# Altium schematic sheet MP3_Decoder.SchDoc
size B
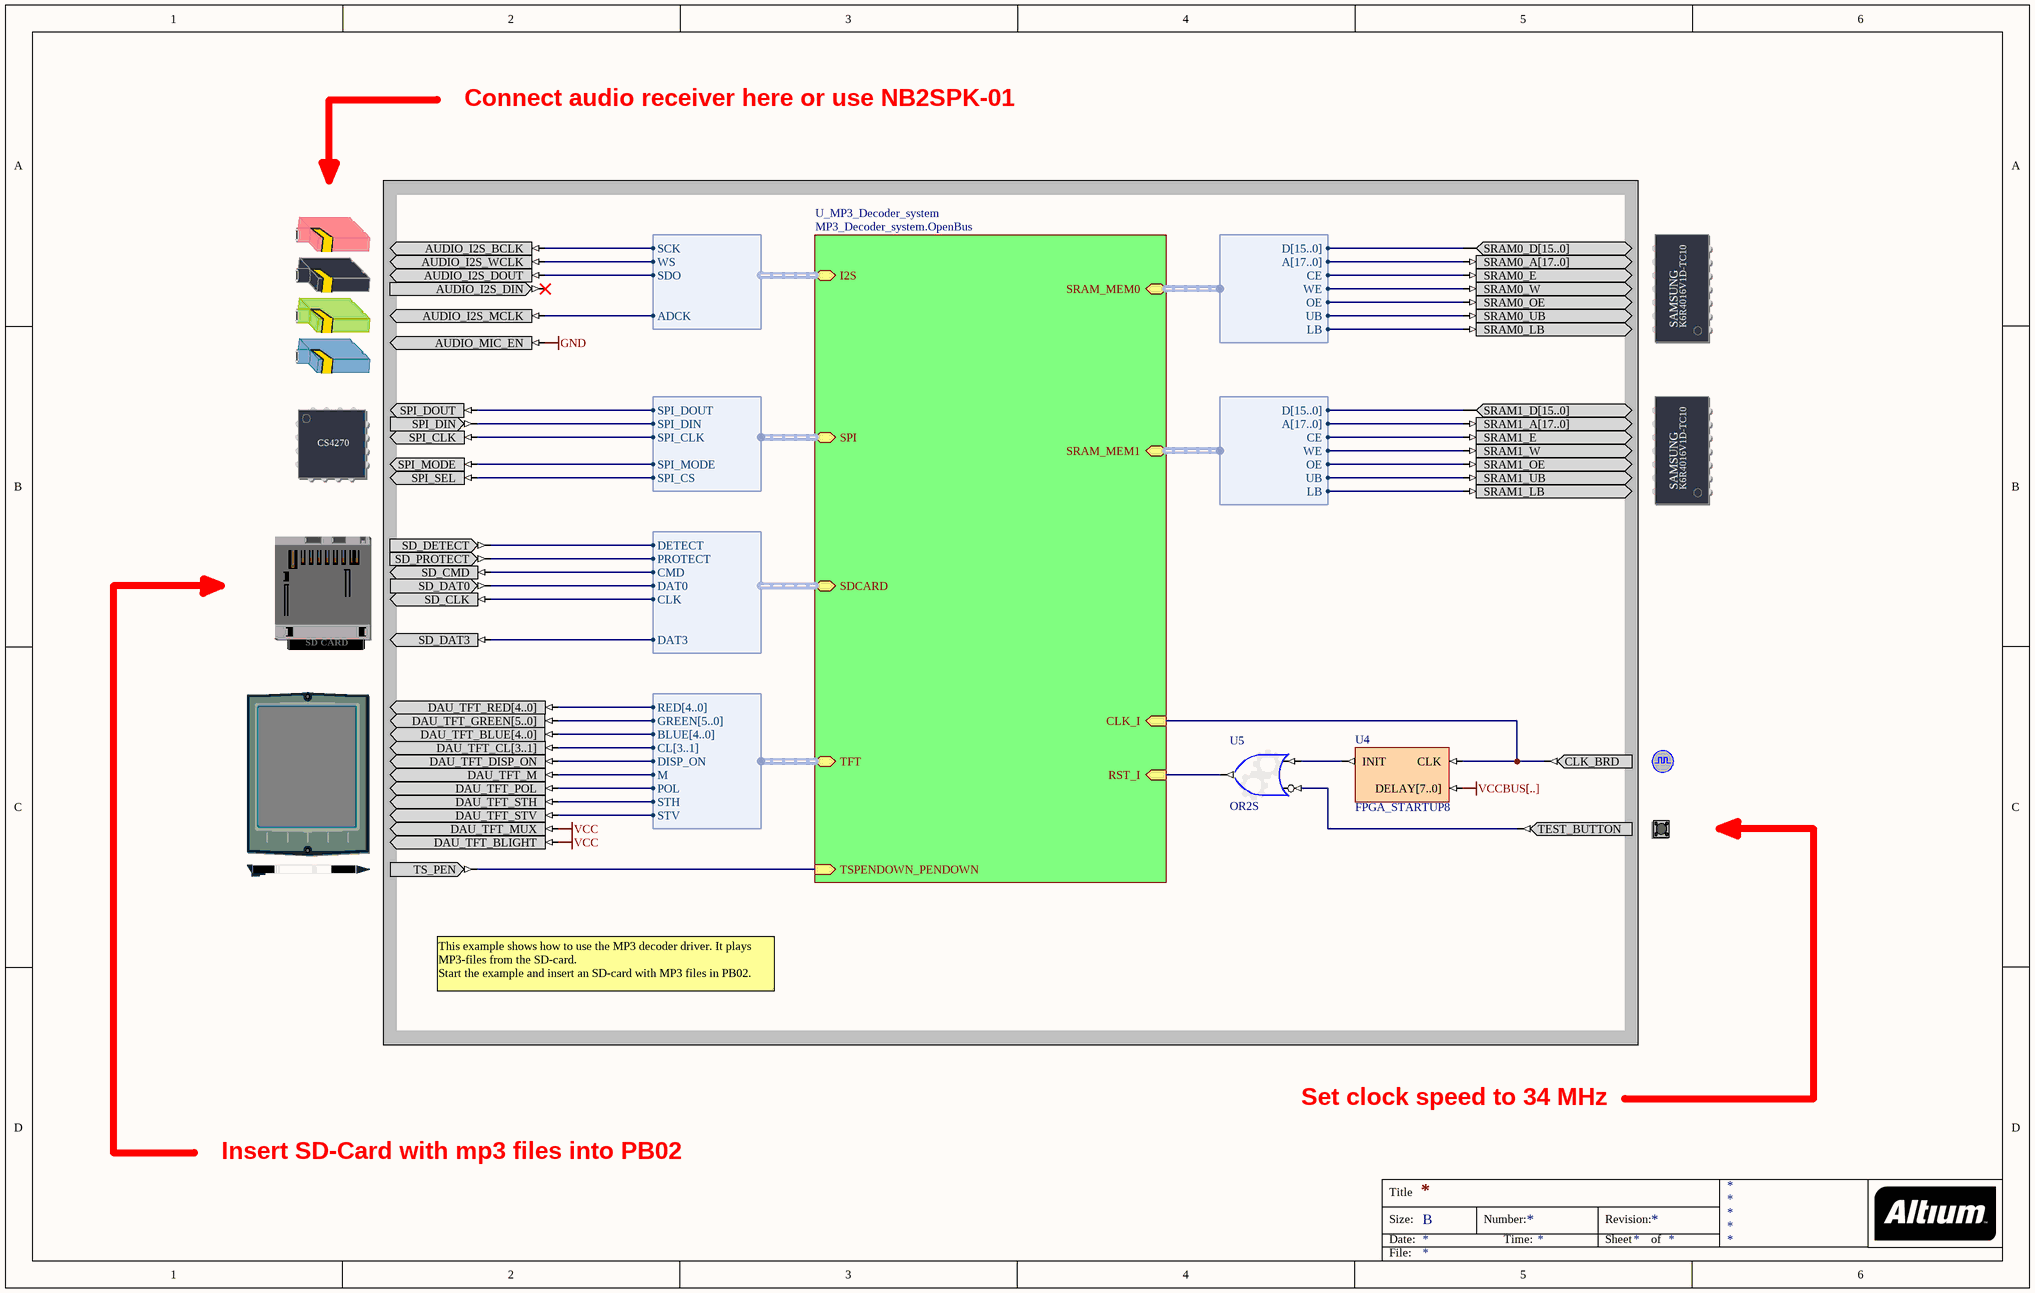
[diagram p0: MP3_Decoder.SchDoc]

## Parts
(Parts that share a designator on the sheet are numbered #1, #2 ... from top to bottom, then left to right.)
?#1  AUDIO_CODEC  (value not drawn)
?#2  SRAM_DAUGHTER0  (value not drawn)
?#3  AUDIO_CODEC_CTRL  (value not drawn)
?#4  SRAM_DAUGHTER1  (value not drawn)
?#5  SD_CARD  (value not drawn)
?#6  TFT_LCD  (value not drawn)
?#7  CLOCK_BOARD  (value not drawn)
?#8  TEST_BUTTON  (value not drawn)
?#9  TOUCHSCREEN_PEN_DOWN  (value not drawn)
U4  FPGA_STARTUP8
U5  OR2S

## Sub-sheets
U_MP3_Decoder_system = MP3_Decoder_system.OpenBus: RST_I (in), CLK_I (in), SRAM_MEM0 (harness WB_MEM_CTRL_SRAM16_A18), SRAM_MEM1 (harness WB_MEM_CTRL_SRAM16_A18), SPI (harness SPI_W_NB), I2S (harness I2S_W_TX), SDCARD (harness WB_SDCARD), TSPENDOWN_PENDOWN (in), TFT (harness VGA32_TFT)

## Harnesses
WB_MEM_CTRL_SRAM16_A18: D[15..0], A[17..0], CE, WE, OE, UB, LB
SPI_W_NB: SPI_DOUT, SPI_DIN, SPI_CLK, SPI_CS, SPI_MODE
I2S_W_TX: SCK, WS, SDO, ADCK
WB_SDCARD: DETECT, PROTECT, CMD, DAT0, CLK, DAT3
VGA32_TFT: RED[4..0], GREEN[5..0], BLUE[4..0], CL[3..1], DISP_ON, M, POL, STH, STV

## Nets
GND: ?#1.AUDIO_MIC_EN
VCC: ?#6.DAU_TFT_BLIGHT ?#6.DAU_TFT_MUX
VCCBUS[..]: U4.DELAY[7..0]
Net?#1_AUDIO_I2S_BCLK: ?#1.AUDIO_I2S_BCLK ; sheet U_MP3_Decoder_system/I2S.SCK
Net?#1_AUDIO_I2S_DOUT: ?#1.AUDIO_I2S_DOUT ; sheet U_MP3_Decoder_system/I2S.SDO
Net?#1_AUDIO_I2S_MCLK: ?#1.AUDIO_I2S_MCLK ; sheet U_MP3_Decoder_system/I2S.ADCK
Net?#1_AUDIO_I2S_WCLK: ?#1.AUDIO_I2S_WCLK ; sheet U_MP3_Decoder_system/I2S.WS
Net?#2_SRAM0_A[17..0]: ?#2.SRAM0_A[17..0] ; sheet U_MP3_Decoder_system/SRAM_MEM0.A[17..0]
Net?#2_SRAM0_D[15..0]: ?#2.SRAM0_D[15..0] ; sheet U_MP3_Decoder_system/SRAM_MEM0.D[15..0]
Net?#2_SRAM0_E: ?#2.SRAM0_E ; sheet U_MP3_Decoder_system/SRAM_MEM0.CE
Net?#2_SRAM0_LB: ?#2.SRAM0_LB ; sheet U_MP3_Decoder_system/SRAM_MEM0.LB
Net?#2_SRAM0_OE: ?#2.SRAM0_OE ; sheet U_MP3_Decoder_system/SRAM_MEM0.OE
Net?#2_SRAM0_UB: ?#2.SRAM0_UB ; sheet U_MP3_Decoder_system/SRAM_MEM0.UB
Net?#2_SRAM0_W: ?#2.SRAM0_W ; sheet U_MP3_Decoder_system/SRAM_MEM0.WE
Net?#3_SPI_CLK: ?#3.SPI_CLK ; sheet U_MP3_Decoder_system/SPI.SPI_CLK
Net?#3_SPI_DIN: ?#3.SPI_DIN ; sheet U_MP3_Decoder_system/SPI.SPI_DIN
Net?#3_SPI_DOUT: ?#3.SPI_DOUT ; sheet U_MP3_Decoder_system/SPI.SPI_DOUT
Net?#3_SPI_MODE: ?#3.SPI_MODE ; sheet U_MP3_Decoder_system/SPI.SPI_MODE
Net?#3_SPI_SEL: ?#3.SPI_SEL ; sheet U_MP3_Decoder_system/SPI.SPI_CS
Net?#4_SRAM1_A[17..0]: ?#4.SRAM1_A[17..0] ; sheet U_MP3_Decoder_system/SRAM_MEM1.A[17..0]
Net?#4_SRAM1_D[15..0]: ?#4.SRAM1_D[15..0] ; sheet U_MP3_Decoder_system/SRAM_MEM1.D[15..0]
Net?#4_SRAM1_E: ?#4.SRAM1_E ; sheet U_MP3_Decoder_system/SRAM_MEM1.CE
Net?#4_SRAM1_LB: ?#4.SRAM1_LB ; sheet U_MP3_Decoder_system/SRAM_MEM1.LB
Net?#4_SRAM1_OE: ?#4.SRAM1_OE ; sheet U_MP3_Decoder_system/SRAM_MEM1.OE
Net?#4_SRAM1_UB: ?#4.SRAM1_UB ; sheet U_MP3_Decoder_system/SRAM_MEM1.UB
Net?#4_SRAM1_W: ?#4.SRAM1_W ; sheet U_MP3_Decoder_system/SRAM_MEM1.WE
Net?#5_SD_CLK: ?#5.SD_CLK ; sheet U_MP3_Decoder_system/SDCARD.CLK
Net?#5_SD_CMD: ?#5.SD_CMD ; sheet U_MP3_Decoder_system/SDCARD.CMD
Net?#5_SD_DAT0: ?#5.SD_DAT0 ; sheet U_MP3_Decoder_system/SDCARD.DAT0
Net?#5_SD_DAT3: ?#5.SD_DAT3 ; sheet U_MP3_Decoder_system/SDCARD.DAT3
Net?#5_SD_DETECT: ?#5.SD_DETECT ; sheet U_MP3_Decoder_system/SDCARD.DETECT
Net?#5_SD_PROTECT: ?#5.SD_PROTECT ; sheet U_MP3_Decoder_system/SDCARD.PROTECT
Net?#6_DAU_TFT_BLUE[4..0]: ?#6.DAU_TFT_BLUE[4..0] ; sheet U_MP3_Decoder_system/TFT.BLUE[4..0]
Net?#6_DAU_TFT_CL[3..1]: ?#6.DAU_TFT_CL[3..1] ; sheet U_MP3_Decoder_system/TFT.CL[3..1]
Net?#6_DAU_TFT_DISP_ON: ?#6.DAU_TFT_DISP_ON ; sheet U_MP3_Decoder_system/TFT.DISP_ON
Net?#6_DAU_TFT_GREEN[5..0]: ?#6.DAU_TFT_GREEN[5..0] ; sheet U_MP3_Decoder_system/TFT.GREEN[5..0]
Net?#6_DAU_TFT_M: ?#6.DAU_TFT_M ; sheet U_MP3_Decoder_system/TFT.M
Net?#6_DAU_TFT_POL: ?#6.DAU_TFT_POL ; sheet U_MP3_Decoder_system/TFT.POL
Net?#6_DAU_TFT_RED[4..0]: ?#6.DAU_TFT_RED[4..0] ; sheet U_MP3_Decoder_system/TFT.RED[4..0]
Net?#6_DAU_TFT_STH: ?#6.DAU_TFT_STH ; sheet U_MP3_Decoder_system/TFT.STH
Net?#6_DAU_TFT_STV: ?#6.DAU_TFT_STV ; sheet U_MP3_Decoder_system/TFT.STV
Net?#7_CLK_BRD: ?#7.CLK_BRD U4.CLK ; sheet U_MP3_Decoder_system/CLK_I
Net?#8_TEST_BUTTON: ?#8.TEST_BUTTON U5.I1
Net?#9_TS_PEN: ?#9.TS_PEN ; sheet U_MP3_Decoder_system/TSPENDOWN_PENDOWN
NetU4_INIT: U4.INIT U5.I0
NetU5_O: U5.O ; sheet U_MP3_Decoder_system/RST_I

Not connected (* = marked no-connect by the designer): ?#1 AUDIO_I2S_DIN*

## Notes on the sheet
- Connect audio receiver here or use NB2SPK-01
- This example shows how to use the MP3 decoder driver. It plays MP3-files from the SD-card.
  Start the example and insert an SD-card with MP3 files in PB02.
- Set clock speed to 34 MHz
- Insert SD-Card with mp3 files into PB02
- Title
- Size:
- Date:
- B
- Number:
- Time:
- Revision:
- Sheet
- of
- File:
- (in symbol AUDIO_CODEC_CTRL) CS4270
- (in symbol SD_CARD) SD CARD
- (in symbol SRAM_DAUGHTER0) SAMSUNG; K6R4016V1D-TC10
- (in symbol SRAM_DAUGHTER1) SAMSUNG; K6R4016V1D-TC10

## Library data of the parts
?#1 = AUDIO_CODEC: Audio Codec; PortComponent: True; IncludeInDSF: AUDIO_CS4270; Published: 22-Jan-2007; Publisher: Altium Limited; HelpURL: https://wiki.altium.com/display/ADOH/PB01+Resources+-+Audio
?#2 = SRAM_DAUGHTER0: Free Static RAM - Daughterboard; PortComponent: True; Published: 14-May-2007; Publisher: Altium Limited; HelpURL: https://wiki.altium.com/display/ADOH/Daughter+Board+Independent+SRAM
?#3 = AUDIO_CODEC_CTRL: Audio Codec Control; PortComponent: True; Published: 22-Jan-2007; Publisher: Altium Limited; HelpURL: https://wiki.altium.com/display/ADOH/PB01+Resources+-+Audio
?#4 = SRAM_DAUGHTER1: Free Static RAM - Daughterboard; PortComponent: True; Published: 14-May-2007; Publisher: Altium Limited; HelpURL: https://wiki.altium.com/display/ADOH/Daughter+Board+Independent+SRAM
?#5 = SD_CARD: Secure Digital Card Socket; PortComponent: True; Published: 22-Jan-2007; Publisher: Altium Limited; UseInDSF: True; HelpURL: https://wiki.altium.com/display/ADOH/PB02+Resources+-+SD+Card+Reader
?#6 = TFT_LCD: TFT LCD Panel; PortComponent: True; Published: 22-Jan-2007; Publisher: Altium Limited; HelpURL: https://wiki.altium.com/display/ADOH/NB2DSK01+-+TFT+LCD+Panel+%28with+Touch+Screen%29
?#7 = CLOCK_BOARD: Global System Clock Supply; PortComponent: True; Published: 19-Nov-2003; Publisher: Altium Limited; HelpURL: https://wiki.altium.com/display/ADOH/NB2DSK01+-+System+Clocks; UseInDSF: True
?#8 = TEST_BUTTON: Test / Reset Button; PortComponent: True; Published: 19-Nov-2003; Publisher: Altium Limited; HelpURL: https://wiki.altium.com/display/ADOH/NB2DSK01+-+Daughter+Board+Test-Reset+Button
?#9 = TOUCH_SCREEN_PEN: TFT Touch Screen Pen; PortComponent: True; Published: 22-Jan-2007; Publisher: Altium Limited; HelpURL: TR0143 Technical Reference Manual for Altium's Desktop NanoBoard NB2DSK01.pdf#page=50
U4 = FPGA_STARTUP8: FPGA Startup With 8 Bit Delay; Published: 9-Dec-2004; Publisher: Altium Limited; HelpURL: CR0119 FPGA_STARTUPx Powerup Delay Unit.pdf; LastRevisionNo: 1.00.00; ComponentLink1Description: Core &Resource Usage; ComponentLink1URL: CR0139 FPGA Peripheral Resource Usage.pdf#page=11
U5 = GATE: Configurable Generic Gate; ConfiguratorName: GENERIC_GATE; ConfigurationParameters: {}Version[1.1]{}GateKind[OR]{}BusInput[False]{}GateInputType[Bit]{}GateOutputOption[Normal]{}BusWidth[8]{}RegisterOutputs[False]{}NegativeClockEdge[False]{}InputCount[2]{}InputInvert0[False]{}InputInvert1[True]{}; LastRevisionNo: 1.00.00; Published: 3-Sep-2008; Publisher: Altium Limited; HelpURL: https://wiki.altium.com/display/ADOH/Configurable+Generic+Library